# Altium schematic sheet Sound_Ram_Buffer.SchDoc
size Tabloid; SheetNumber: 3; SheetTotal: 4
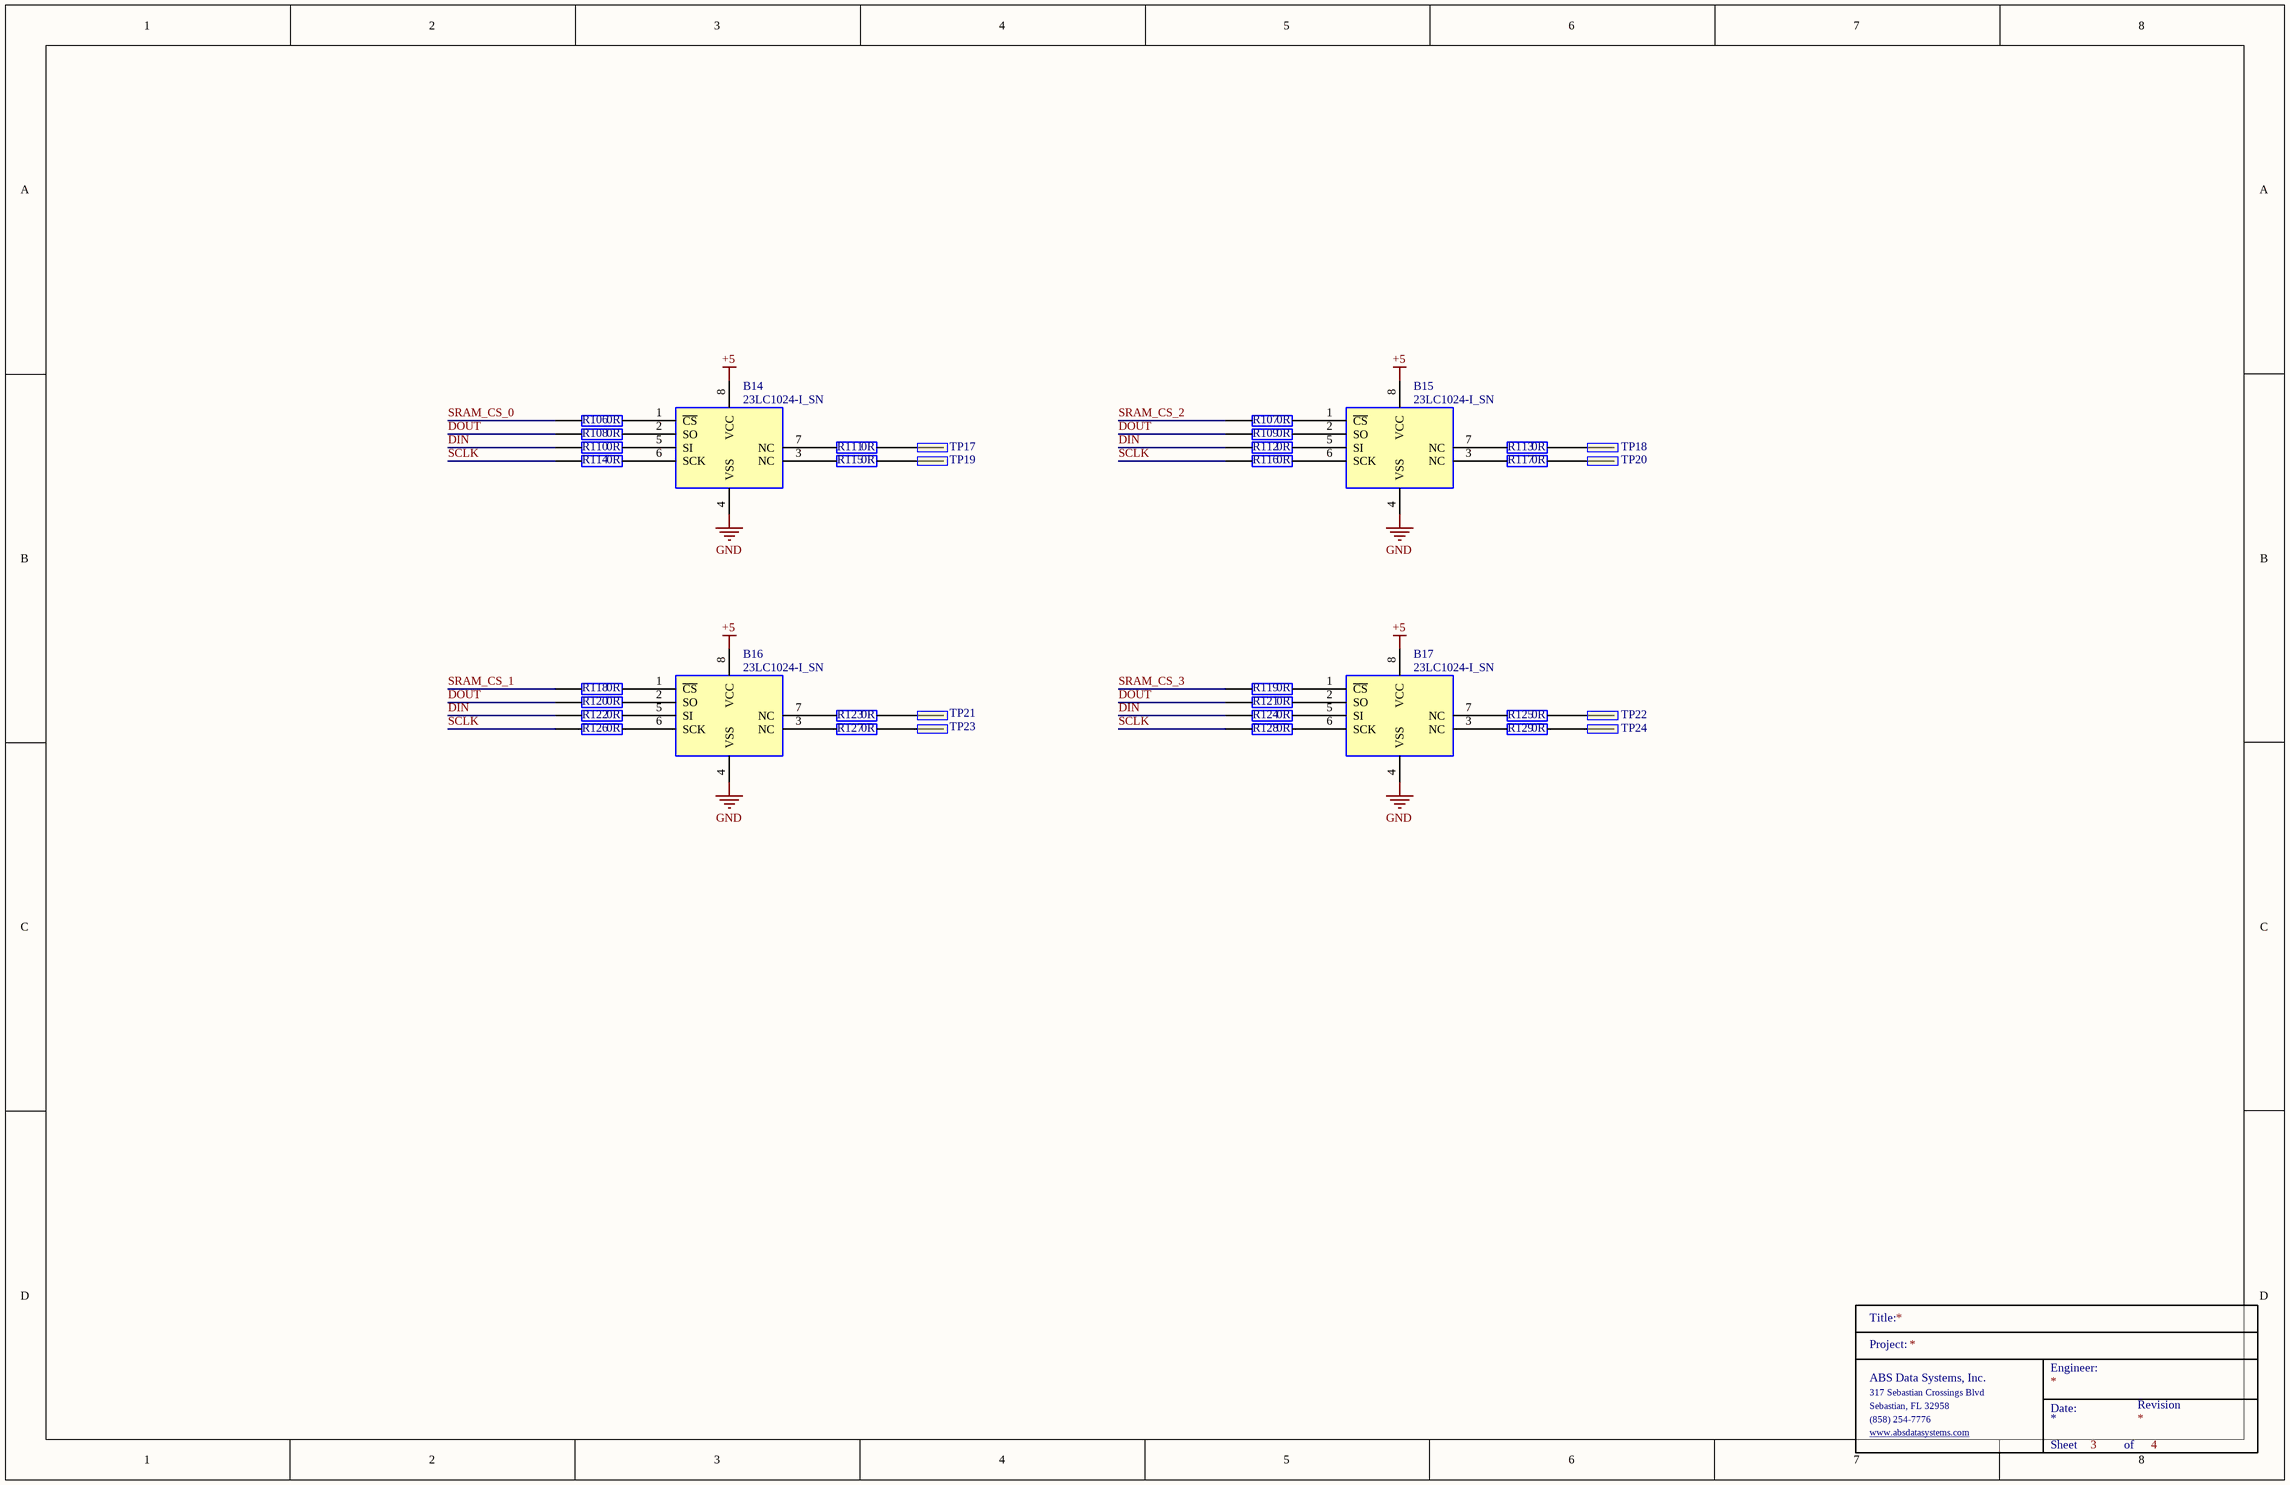
[diagram p0: Sound_Ram_Buffer.SchDoc]

## Parts
B14  23LC1024-I_SN  [SOIC127P600X175-8N]
B15  23LC1024-I_SN  [SOIC127P600X175-8N]
B16  23LC1024-I_SN  [SOIC127P600X175-8N]
B17  23LC1024-I_SN  [SOIC127P600X175-8N]
R106  0R  [0603]
R107  0R  [0603]
R108  0R  [0603]
R109  0R  [0603]
R110  0R  [0603]
R111  0R  [0603]
R112  0R  [0603]
R113  0R  [0603]
R114  0R  [0603]
R115  0R  [0603]
R116  0R  [0603]
R117  0R  [0603]
R118  0R  [0603]
R119  0R  [0603]
R120  0R  [0603]
R121  0R  [0603]
R122  0R  [0603]
R123  0R  [0603]
R124  0R  [0603]
R125  0R  [0603]
R126  0R  [0603]
R127  0R  [0603]
R128  0R  [0603]
R129  0R  [0603]
TitleBlock_?  TitleBlock  (value not drawn)  (graphical)
TP17  TP  [TP]  (value not drawn)
TP18  TP  [TP]  (value not drawn)
TP19  TP  [TP]  (value not drawn)
TP20  TP  [TP]  (value not drawn)
TP21  TP  [TP]  (value not drawn)
TP22  TP  [TP]  (value not drawn)
TP23  TP  [TP]  (value not drawn)
TP24  TP  [TP]  (value not drawn)

## Nets
+5: B14.8(VCC) B15.8(VCC) B16.8(VCC) B17.8(VCC)
GND: B14.4(VSS) B15.4(VSS) B16.4(VSS) B17.4(VSS)
DIN: R110.1 R112.1 R122.1 R124.1
DOUT: R108.1 R109.1 R120.1 R121.1
SCLK: R114.1 R116.1 R126.1 R128.1
SRAM_CS_0: R106.1
SRAM_CS_1: R118.1
SRAM_CS_2: R107.1
SRAM_CS_3: R119.1
NetB14_1: B14.1(~{CS}) R106.2
NetB14_2: B14.2(SO) R108.2
NetB14_3: B14.3(NC) R115.1
NetB14_5: B14.5(SI) R110.2
NetB14_6: B14.6(SCK) R114.2
NetB14_7: B14.7(NC) R111.1
NetB15_1: B15.1(~{CS}) R107.2
NetB15_2: B15.2(SO) R109.2
NetB15_3: B15.3(NC) R117.1
NetB15_5: B15.5(SI) R112.2
NetB15_6: B15.6(SCK) R116.2
NetB15_7: B15.7(NC) R113.1
NetB16_1: B16.1(~{CS}) R118.2
NetB16_2: B16.2(SO) R120.2
NetB16_3: B16.3(NC) R127.1
NetB16_5: B16.5(SI) R122.2
NetB16_6: B16.6(SCK) R126.2
NetB16_7: B16.7(NC) R123.1
NetB17_1: B17.1(~{CS}) R119.2
NetB17_2: B17.2(SO) R121.2
NetB17_3: B17.3(NC) R129.1
NetB17_5: B17.5(SI) R124.2
NetB17_6: B17.6(SCK) R128.2
NetB17_7: B17.7(NC) R125.1
NetR111_2: R111.2 TP17.1
NetR113_2: R113.2 TP18.1
NetR115_2: R115.2 TP19.1
NetR117_2: R117.2 TP20.1
NetR123_2: R123.2 TP21.1
NetR125_2: R125.2 TP22.1
NetR127_2: R127.2 TP23.1
NetR129_2: R129.2 TP24.1

## Notes on the sheet
- (in symbol TitleBlock) Title:; Project:; Engineer:; ABS Data Systems, Inc.; 317 Sebastian Crossings Blvd; Sebastian, FL 32958; Date:; Revision; (858) 254-7776; www.absdatasystems.com; Sheet; of

## Library data of the parts
B14-B17 = 23LC1024-I_SN: SRAM,1Mbit,2.5V,20MHz,SPI/SDI/SQI,SOIC8 23LC1024-I/SN,  SRAM Memory 1Mbit, 128K words x 8 bit, 20MHz,, 2.5 to 5.5 V, 8-Pin, SOIC; Manufacturer_Name: Microchip; Geometry.Height: 1.75mm; Mouser Part Number: 579-23LC1024-I/SN; Mouser Price/Stock: https://www.mouser.co.uk/ProductDetail/Microchip-Technology-Atmel/23LC1024-I-SN?qs=q1LPnGnpSmb1WpXt0vqW%2FQ%3D%3D; Manufacturer_Part_Number: 23LC1024-I/SN; Datasheet Link: http://ww1.microchip.com/downloads/en/DeviceDoc/20005142C.pdf
R106-R129 = RC0603JR-070RL: YAGEO 0603 0 ohm; Manufacturer_Name: KEMET; Geometry.Height: 0.55mm; Mouser Part Number: 603-RC0603JR-070RL; Mouser Price/Stock: https://www.mouser.co.uk/ProductDetail/YAGEO/RC0603JR-070RL?qs=2cAdsCoAWRGWyPcuXgGiXQ%3D%3D; Manufacturer_Part_Number: RC0603JR-070RL; Datasheet Link: https://datasheet.datasheetarchive.com/originals/distributors/Datasheets_SAMA/902f9e387b938f871d31120f5fc1d65e.pdf
TP17-TP24 = TP: Manufacturer: Samtec; Manufacturer Part Number: TST-105-01-G-D; Number of Contacts: 16; Gender: Male; Connector Type: Male Pin; Pitch: 2.54mm; Row Spacing: 0.1inch; Supplier 1: Digi-Key; RoHS: Yes; Category: Headers and Wire Housings; Stock 1: 227; Pricing 1: 1=2.85000, 10=2.73600, 100=2.28000, 500=1.93800, 1000=1.65300, 5000=1.48200 (USD); Mount: Through Hole; Contact Plating: Gold; Contact Material: Bronze; Housing Material: Polyester; Housing Color: Black; Color: Black; Min Operating Temperature: -55°C; Max Operating Temperature: 125°C; Number of Rows: 2; Termination: Solder; Packaging: Rail/Tube; Orientation: Straight; Number of Positions: 16; Length: 27.94mm; Depth: 9.27mm; Contact Mating Length: 0.25inch; REACH SVHC: No SVHC; ComponentLink1URL: https://datasheet.ciiva.com/739/tst-mkt-739845.pdf?src-supplier=Digi-Key; ComponentLink1Description: https://datasheet.ciiva.com/739/tst-mkt-739845.pdf?src-supplier=Digi-Key; ComponentLink2URL: https://datasheet.ciiva.com/10018/htst-10018510.pdf?src-supplier=Avnet; ComponentLink2Description: https://datasheet.ciiva.com/10018/htst-10018510.pdf?src-supplier=Avnet